# Altium schematic sheet SPITEMP3.SchDoc
size A
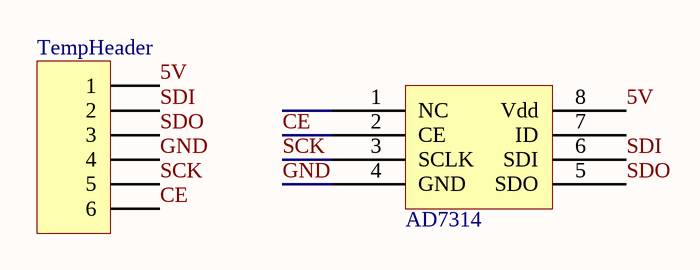
[diagram p0: SPITEMP3.SchDoc]

## Parts
AD7314  SPI Temp Sensor  [AD7314]  (value not drawn)
TempHeader  Header 6  [HDR1X6]  (value not drawn)

## Nets
5V: AD7314.8(Vdd) TempHeader.1
CE: AD7314.2(CE) TempHeader.6
GND: AD7314.4(GND) TempHeader.4
SCK: AD7314.3(SCLK) TempHeader.5
SDI: AD7314.6(SDI) TempHeader.2
SDO: AD7314.5(SDO) TempHeader.3

Not connected (* = marked no-connect by the designer): AD7314 1(NC) 7(ID)

## Library data of the parts
AD7314 = AD7314: SPI Temp Sensor (8-lead MSOP
TempHeader = Header 6: Header, 6-Pin; LatestRevisionDate: 17-Jul-2002; LatestRevisionNote: Re-released for DXP Platform.; Publisher: Altium Limited